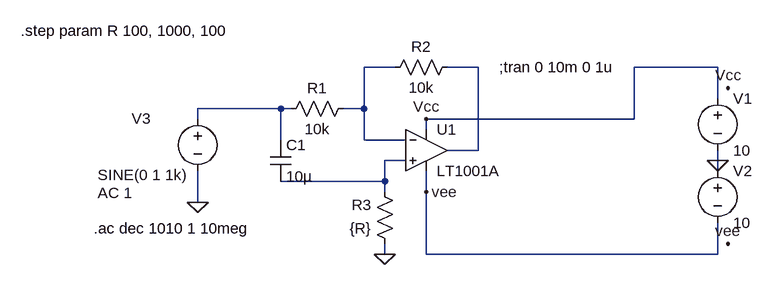
[diagram p0: schematic PhaseShifter.asc]
PhaseShifter.asc, the LTspice schematic file:
Version 4
SHEET 1 880 680
WIRE 272 -16 224 -16
WIRE 400 -16 352 -16
WIRE 768 -16 640 -16
WIRE 768 32 768 -16
WIRE 96 48 -32 48
WIRE 112 48 96 48
WIRE 224 48 224 -16
WIRE 224 48 192 48
WIRE -32 64 -32 48
WIRE 640 64 640 -16
WIRE 640 64 320 64
WIRE 320 80 320 64
WIRE 96 96 96 48
WIRE 224 96 224 48
WIRE 288 96 224 96
WIRE 400 112 400 -16
WIRE 400 112 352 112
WIRE 288 128 256 128
WIRE 768 128 768 112
WIRE 768 144 768 128
WIRE 256 160 256 128
WIRE 256 160 96 160
WIRE 256 176 256 160
WIRE 320 176 320 144
WIRE -32 192 -32 144
WIRE 256 272 256 256
WIRE 320 272 320 176
WIRE 768 272 768 224
WIRE 768 272 320 272
FLAG -32 192 0
FLAG 256 272 0
FLAG 768 128 0
FLAG 784 256 vee
FLAG 784 16 Vcc
FLAG 320 64 Vcc
FLAG 320 176 vee
SYMBOL cap 80 96 R0
SYMATTR InstName C1
SYMATTR Value 10µ
SYMBOL res 208 32 R90
WINDOW 0 0 56 VBottom 2
WINDOW 3 32 56 VTop 2
SYMATTR InstName R1
SYMATTR Value 10k
SYMBOL res 368 -32 R90
WINDOW 0 0 56 VBottom 2
WINDOW 3 32 56 VTop 2
SYMATTR InstName R2
SYMATTR Value 10k
SYMBOL res 272 272 R180
WINDOW 0 36 76 Left 2
WINDOW 3 36 40 Left 2
SYMATTR InstName R3
SYMATTR Value {R}
SYMBOL voltage 768 16 R0
WINDOW 123 0 0 Left 2
WINDOW 39 0 0 Left 2
SYMATTR InstName V1
SYMATTR Value 10
SYMBOL voltage 768 128 R0
WINDOW 123 0 0 Left 2
WINDOW 39 0 0 Left 2
SYMATTR InstName V2
SYMATTR Value 10
SYMBOL Opamps\\LT1001A 320 48 R0
SYMATTR InstName U1
SYMBOL voltage -32 48 R0
WINDOW 0 -101 15 Left 2
WINDOW 3 -154 102 Left 2
WINDOW 123 -154 130 Left 2
WINDOW 39 0 0 Left 2
SYMATTR InstName V3
SYMATTR Value SINE(0 1 1k)
SYMATTR Value2 AC 1
TEXT 432 -16 Left 2 !;tran 0 10m 0 1u
TEXT -304 -72 Left 2 !.step param R 100, 1000, 100
TEXT -192 232 Left 2 !.ac dec 1010 1 10meg

The netlist it stands for:
* PhaseShifter.asc
C1 N003 N004 10µ
R1 N001 N003 10k
R2 N002 N001 10k
R3 0 N004 {R}
V1 Vcc 0 10
V2 0 vee 10
XU1 N004 N001 Vcc vee N002 LT1001  ; LT1001A, pins In+ In- V+ V- OUT
V3 N003 0 SINE(0 1 1k) AC 1
;tran 0 10m 0 1u
.step param R 100, 1000, 100
.ac dec 1010 1 10meg
.lib LTC.lib
.backanno
.end